# EAGLE design EEZ AUX PS r5B8 (EAGLE 6.1)
Assembly variants: Farnell, TME

## Sheet 1 of 2
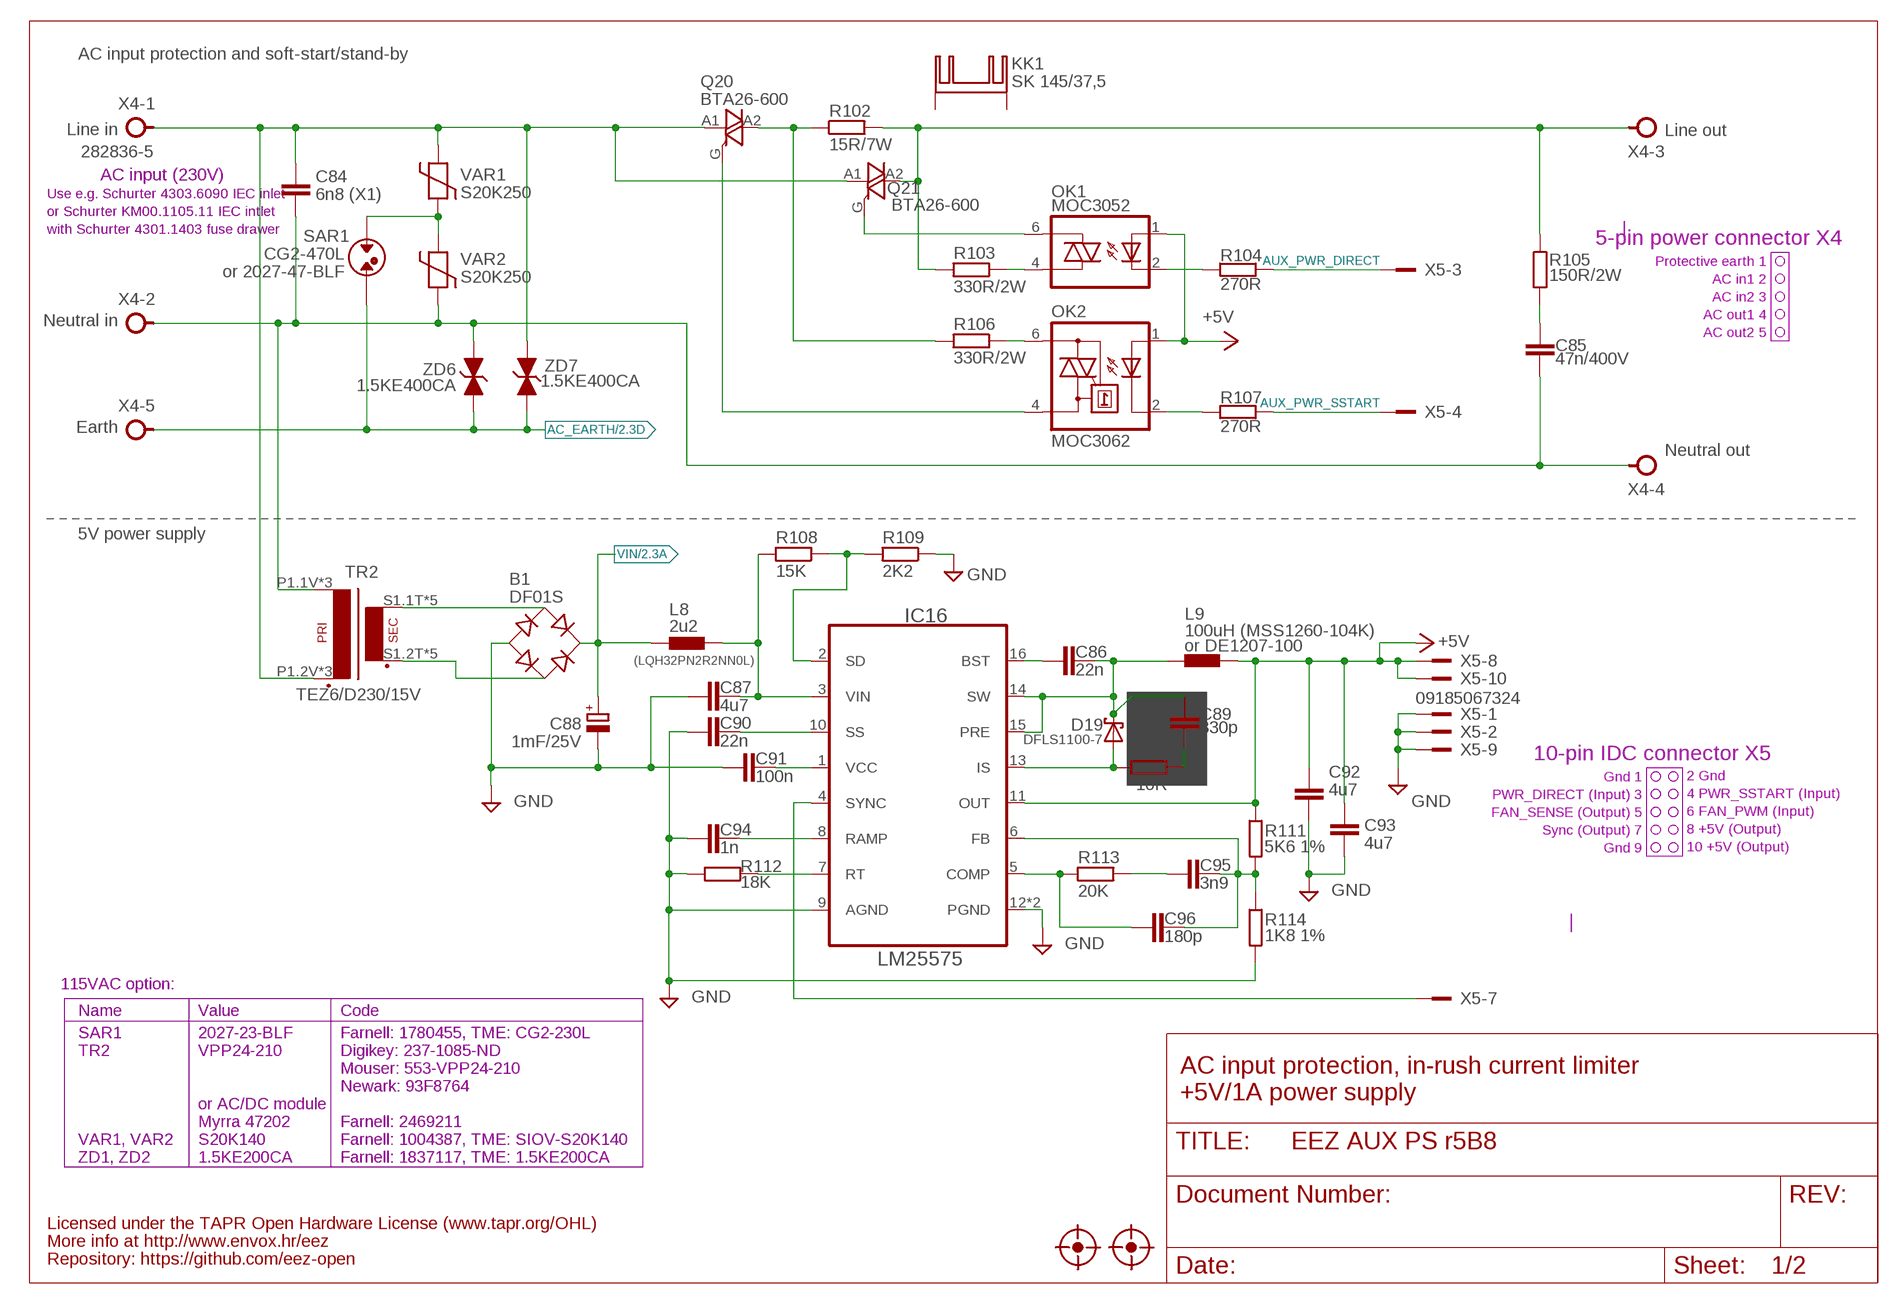
[diagram p0: schematic, sheet 1]

### Parts
B1  DF01S  [DFS]
C84  6n8 (X1)  C-EU102-064X133  [C102-064X133]
C85  47n/400V  C-EU075-052X106  [C075-052X106]
C86  22n  C-EUC0805  [C0805]
C87  4u7  C-EUC1210  [C1210]
C88  1mF/25V  ECAP5G_10.5MM  [ECAP5/10.5]
C89  330p  C-EUC0805  [C0805]
C90  22n  C-EUC0805  [C0805]
C91  100n  C-EUC0805  [C0805]
C92  4u7  C-EUC1210  [C1210]
C93  4u7  C-EUC1210  [C1210]
C94  1n  C-EUC0805  [C0805]
C95  3n9  C-EUC0805  [C0805]
C96  180p  C-EUC0805  [C0805]
D19  DFLS1100-7  SCHOTTKYSOD123  [SOD123]
IC16  LM25575  LM(2)5575  [SOP65P640X110-17N]
KK1  SK 145/37,5  SK145  [SK145]
L8  2u2  L1210  [L1210]
L9  100uH (MSS1260-104K)  COILCRAFT_MSS1278  [MSS1278]
OK1  MOC3052  MOC305X  [DIL6-SMD]
OK2  MOC3062  MOC3033S  [DIL6-SMD]
Q20  BTA26-600  BTA26-V  [TOP3S-1]
Q21  BTA26-600  BTA26-V  [TOP3S-1]
R102  15R/7W  R_EU7W  [R_0913]
R103  330R/2W  R-EU_R2512  [R2512]
R104  270R  R-EU_R0805  [R0805]
R105  150R/2W  R-EU_R2512  [R2512]
R106  330R/2W  R-EU_R2512  [R2512]
R107  270R  R-EU_R0805  [R0805]
R108  15K  R-EU_R0805  [R0805]
R109  2K2  R-EU_R0805  [R0805]
R110  10R  R-EU_R1206  [R1206]
R111  5K6 1%  R-EU_R0805  [R0805]
R112  18K  R-EU_R0805  [R0805]
R113  20K  R-EU_R0805  [R0805]
R114  1K8 1%  R-EU_R0805  [R0805]
SAR1  CG2-470L  SAR  [SAR]
TR2  TEZ6/D230/15V  PCB_TRAFO6VA_TEZ+VPP+MYRRA  [PCB_TRAFO6VA_7.5W]
U$13  FIDUCIAL_2  [FIDUCIAL_DUAL]
U$14  FIDUCIAL_2  [FIDUCIAL_DUAL]
VAR1  S20K250  VARISTOR  [VARISTOR]
VAR2  S20K250  VARISTOR  [VARISTOR]
X4  282836-5  TBLOCK5.0_5A  [TBLOCK5.0_5]
X5  09185067324  IDC-10PINBLACK  [IDC-10PIN]
ZD6  1.5KE400CA  1.5KE-BIDIR  [DO201-BIDIR]
ZD7  1.5KE400CA  1.5KE-BIDIR  [DO201-BIDIR]

### Nets
+5V: C92.1 C93.1 IC16.11(OUT) L9.2 OK1.1(A) OK2.1(A) R111.1 X5.8 X5.10 ; also sheet 2
AC_EARTH: SAR1.P$2 X4.5 ZD6.C ZD7.C ; also sheet 2
AC_IN1_MAIN: C84.1 Q20.A1 Q21.A1 TR2.P1.2V(P2) TR2.P2.2V(P2) TR2.P2_TEZ(P2) VAR1.P$2 X4.1 ZD7.A
AC_IN2_MAIN: C84.2 C85.1 TR2.P1.1V(P1) TR2.P1_TEZ(P1) TR2.P2.1V(P1) VAR2.P$1 X4.2 X4.4 ZD6.A
AUX_PWR_DIRECT: R104.2 X5.3
AUX_PWR_SSTART: R107.2 X5.4
DC_PREG2: C87.1 IC16.3(VIN) L8.2 R108.2
GND [gnd]: B1.- C87.2 C88.- C90.2 C91.1 C92.2 C93.2 C94.1 IC16.9(AGND) IC16.12(PGND) IC16.TP(PGND) R109.1 R112.2 R114.2 X5.1 X5.2 X5.9 ; also sheet 2
IS1: D19.A IC16.13(IS) R110.1
N$52: C95.2 R113.2
N$57: C95.1 C96.1 IC16.6(FB) R111.2 R114.1
N$58: C86.2 IC16.16(BST)
N$59: C96.2 IC16.5(COMP) R113.1
N$60: IC16.7(RT) R112.1
N$61: C91.2 IC16.1(VCC)
N$63: C94.2 IC16.8(RAMP)
N$66: C90.1 IC16.10(SS)
N$68: IC16.4(SYNC) X5.7
N$69: IC16.2(SD) R108.1 R109.2
N$70: C89.2 R110.2
N$71: OK1.6(A2) Q21.G
N$72: OK2.4(A1) Q20.G
N$73: OK2.6(A2) R106.1
N$74: OK1.2(C) R104.1
N$75: OK2.2(C) R107.1
N$76: OK1.4(A1) R103.1
N$78: B1.AC1 TR2.S1.1T(S1) TR2.S1.1V(S1) TR2.S2.1T(S1) TR2.S2.1V(S1) TR2.S2M(S1)
N$80: B1.AC2 TR2.S1.2T(S2) TR2.S1.2V(S2) TR2.S1M(S2) TR2.S2.2T(S2) TR2.S2.2V(S2)
N$81: Q20.A2 R102.1 R106.2
N$82: Q21.A2 R102.2 R103.2 R105.1 X4.3
N$83: C85.2 R105.2
N$114: SAR1.P$1 VAR1.P$1 VAR2.P$2
SW2: C86.1 C89.1 D19.C IC16.14(SW) IC16.15(PRE) L9.1
VIN: B1.+ C88.+ L8.1 ; also sheet 2
Unconnected: KK1.1(K) KK1.2(K)

### Notes on the sheet
- AC input protection and soft-start/stand-by
- Line in
- Line out
- AC input (230V)
- Use e.g. Schurter 4303.6090 IEC inlet
- or Schurter KM00.1105.11 IEC intlet
- 5-pin power connector X4
- with Schurter 4301.1403 fuse drawer
- Protective earth 1
- or 2027-47-BLF
- AC in1 2
- AC in2 3
- AC out1 4
- Neutral in
- AC out2 5
- Earth
- Neutral out
- 5V power supply
- or DE1207-100
- (LQH32PN2R2NN0L)
- 10-pin IDC connector X5
- Gnd 1
- 2 Gnd
- PWR_DIRECT (Input) 3
- 4 PWR_SSTART (Input)
- FAN_SENSE (Output) 5
- 6 FAN_PWM (Input)
- Sync (Output) 7
- 8 +5V (Output)
- Gnd 9
- 10 +5V (Output)
- 115VAC option:
- Name | Value | Code
- SAR1 | 2027-23-BLF | Farnell: 1780455, TME: CG2-230L
- TR2 | VPP24-210 | Digikey: 237-1085-ND
- Mouser: 553-VPP24-210 | AC input protection, in-rush current limiter
- Newark: 93F8764
- +5V/1A power supply
- or AC/DC module
- Myrra 47202 | Farnell: 2469211
- VAR1, VAR2 | S20K140 | Farnell: 1004387, TME: SIOV-S20K140
- ZD1, ZD2 | 1.5KE200CA | Farnell: 1837117, TME: 1.5KE200CA
- Licensed under the TAPR Open Hardware License (www.tapr.org/OHL)
- More info at http://www.envox.hr/eez
- Repository: https://github.com/eez-open

## Sheet 2 of 2
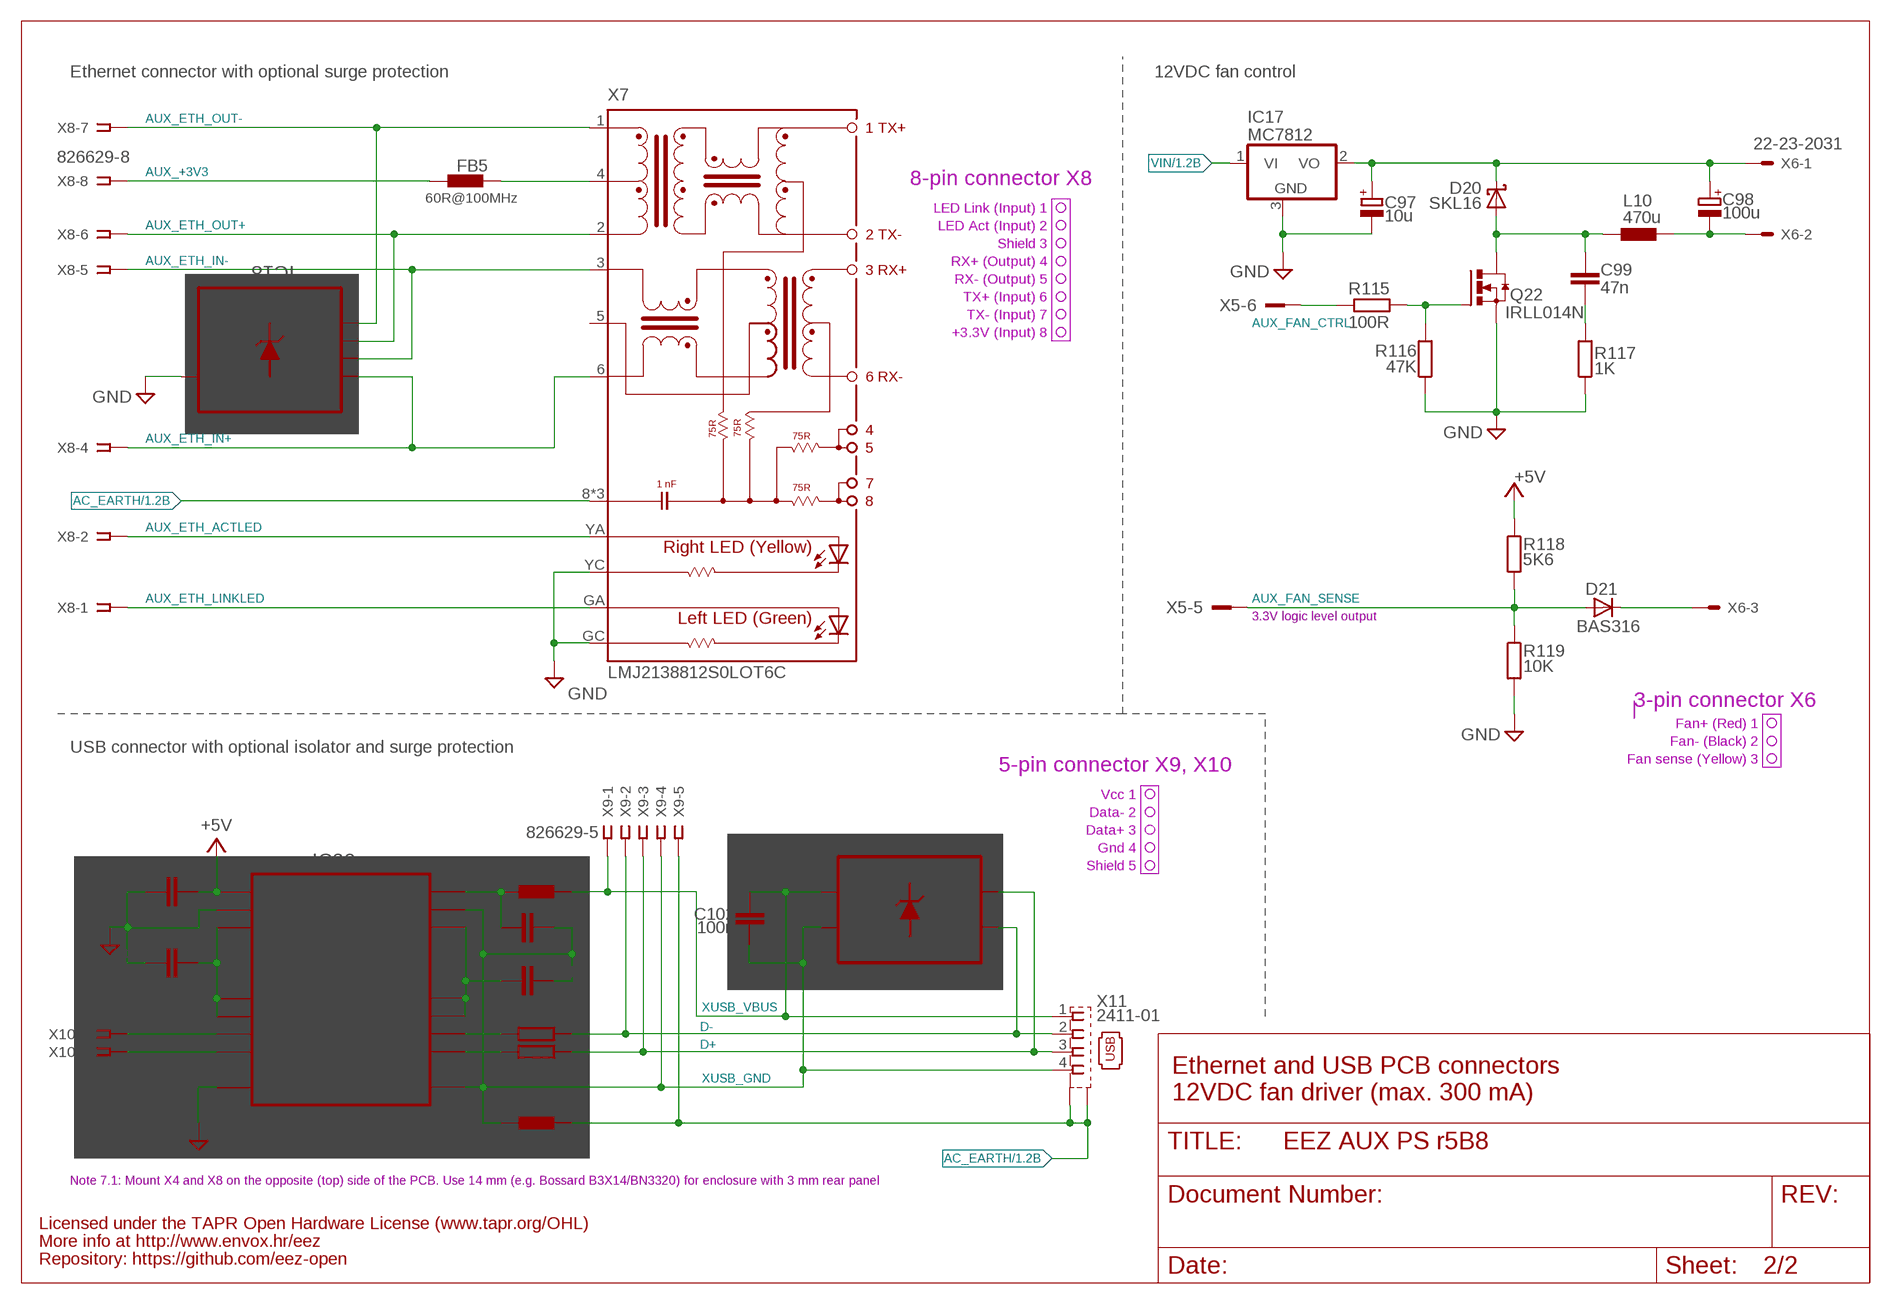
[diagram p1: schematic, sheet 2]

### Parts
C97  10u  ECAPPANASONIC_C  [PANASONIC_C]
C98  100u  ECAPPANASONIC_H  [CAPAE660X610N]
C99  47n  C-EUC0805  [C0805]
C100  100n  C-EUC0603  [C0603]
C101  100n  C-EUC0603  [C0603]
C102  100n  C-EUC0603  [C0603]
C103  100n  C-EUC0603  [C0603]
C104  100n  C-EUC0603  [C0603]
D20  SKL16  SCHOTTKYSOD123  [SOD123]
D21  BAS316  DIODE-SOD323-W  [SOD323-W]
FB5  60R@100MHz  FERRITE_BEAD0603  [BEAD0603]
FB6  60R@100MHz  FERRITE_BEAD0603  [BEAD0603]
FB7  60R@100MHz  FERRITE_BEAD0603  [BEAD0603]
IC17  MC7812  MC78XX  [TO252]
IC18  TPD4E002DRLR  [SOT50P280X60-5N]
IC19  TPD2E001DZDR  [SOP192P292X122-4N]
IC20  ADUM3160BRWZ  ADUM3160BRWZWIDE  [SOIC-16W]
L10  470u  DE0704  [DE0704]
Q22  IRLL014N  N-HEXFET-2D_SOT232-IRLL014N  [SOT223]
R115  100R  R-EU_R0805  [R0805]
R116  47K  R-EU_R0805  [R0805]
R117  1K  R-EU_R0805  [R0805]
R118  5K6  R-EU_R0805  [R0805]
R119  10K  R-EU_R0805  [R0805]
R120  22R  R-EU_R0805  [R0805]
R121  22R  R-EU_R0805  [R0805]
X6  22-23-2031  [22-23-2031]
X7  LMJ2138812S0LOT6C  RJ45-VERT  [RJ45-VERT]
X8  826629-8  SSW-108-02-S-S  [SSW-108-02-S-S]
X9  826629-5  SSW-105-02-S-S  [SSW-105-02-S-S]
X10  826629-5  SSW-105-02-S-S  [SSW-105-02-S-S]
X11  2411-01  KUSBVX-BS1N  [KUSBVX-BS1N]

### Nets
12VDC: C97.1(+) C98.1(+) D20.C IC17.2(VO) X6.1
+5V: C100.1 IC20.16(VBUS2) R118.1 ; also sheet 1
AC_EARTH: FB7.P$1 X7.8(SH) X7.SH1(SH) X7.SH2(SH) X9.5 X11.M1(S1) X11.M2(S2) ; also sheet 1
AUX_+3V3: FB5.P$2 X8.8
AUX_ETH_ACTLED: X7.YA(YELLOW_A) X8.2
AUX_ETH_IN+: IC18.5(IO4) X7.6(RD-) X8.4
AUX_ETH_IN-: IC18.4(IO3) X7.3(RD+) X8.5
AUX_ETH_LINKLED: X7.GA(GREEN-A) X8.1
AUX_ETH_OUT+: IC18.3(IO2) X7.2(TD-) X8.6
AUX_ETH_OUT-: IC18.1(IO1) X7.1(TD+) X8.7
AUX_FAN_CTRL: R115.2 X5.6
AUX_FAN_SENSE: D21.A R118.2 R119.1 X5.5
D+: IC19.2(IO1) R121.1 X9.3 X11.3
D-: IC19.3(IO2) R120.1 X9.2 X11.2
FAN_OUT: C99.2 D20.A L10.2 Q22.2(D) Q22.4(D)
GND [gnd]: C97.2(-) C100.2 C103.2 IC17.3(GND) IC18.2(GND) IC20.9(GND2) IC20.15(GND2_2) Q22.3(S) R116.1 R117.1 R119.2 X7.GC(GREEN-C) X7.YC(YELLOW-C) ; supply symbol labelled PGND ; also sheet 1
MCU_D+: IC20.10(DD+) X10.3
MCU_D-: IC20.11(DD-) X10.2
N$84: C99.1 R117.2
N$85: Q22.1(G) R115.1 R116.2
N$86: C98.2(-) L10.1 X6.2
N$87: C104.1 IC20.3(VDD1) IC20.4(PDEN) IC20.5(SPU)
N$88: IC20.6(UD-) R120.2
N$89: IC20.7(UD+) R121.2
N$90: C101.1 FB6.P$2 IC20.1(VBUS1)
N$91: C103.1 IC20.12(PIN) IC20.13(SPD) IC20.14(VDD2)
N$125: FB5.P$1 X7.4(CT)
N$163: D21.C X6.3
VIN: IC17.1(VI) ; also sheet 1
XUSB_GND: C101.2 C102.1 C104.2 FB7.P$2 IC19.1(GND) IC20.2(GND1_2) IC20.8(GND1) X9.4 X11.4
XUSB_VBUS: C102.2 FB6.P$1 IC19.4(VCC) X9.1 X11.1
Unconnected: X7.5(CR) X8.3 X10.1 X10.4 X10.5

### Notes on the sheet
- Ethernet connector with optional surge protection | 12VDC fan control
- 8-pin connector X8
- LED Link (Input) 1
- LED Act (Input) 2
- Shield 3
- RX+ (Output) 4
- RX- (Output) 5
- TX+ (Input) 6
- TX- (Input) 7
- +3.3V (Input) 8
- 3.3V logic level output
- 3-pin connector X6
- Fan+ (Red) 1
- Fan- (Black) 2
- USB connector with optional isolator and surge protection
- Fan sense (Yellow) 3
- 5-pin connector X9, X10
- Vcc 1
- Data- 2
- Data+ 3
- Gnd 4
- Shield 5
- Ethernet and USB PCB connectors
- 12VDC fan driver (max. 300 mA)
- Note 7.1: Mount X4 and X8 on the opposite (top) side of the PCB. Use 14 mm (e.g. Bossard B3X14/BN3320) for enclosure with 3 mm rear panel
- Licensed under the TAPR Open Hardware License (www.tapr.org/OHL)
- More info at http://www.envox.hr/eez
- Repository: https://github.com/eez-open

## Library data of the parts
B1 = rectifier:DF*S: Surface Mount Glass Passivated Bridge Rectifiers Source: Source: Comchip Bridge Rectifiers DF005S-G thru DF10S-G.pdf
C84-C87 C89-C96 C99-C104 = rcl:C-EU: CAPACITOR, European symbol
C88 C98 = EEZ_Lib1:ECAP
C97 = MyLib6:ECAP
D19 D20 = EEZ_Lib1:SCHOTTKY
D21 = diode:DIODE-: DIODE
FB5-FB7 = MyLib6:FERRITE_BEAD: FAIR-RITE - 2506033007Y3 - FERRITE BEAD, 0.04OHM, 3A, 0603 Farnell: 2112873
IC16 = EEZ_Lib1:LM(2)5575: Simple Switcher® 42V, 1.5A Step-Down Switching Regulator
IC17 = EEZ_Lib1:MC78XX: 1.0 A Positive Voltage Regulators
IC18 = EEZ_Lib1:TPD4E002: Low-Capacitance 4-Channel +/-15-kV ESD Protection Array for High-Speed Data Interfaces
IC19 = EEZ_Lib1:TPD2E001: Low-Capacitance 2-Channel +/-15 kV ESD-Protection Array for High-Speed Data Interfaces
IC20 = MyLib6:ADUM3160BRWZ: Full/Low Speed 2.5 kV USB Digital Isolator
KK1 = EEZ_Lib1:SK145: FISCHER ELEKTRONIK SK 145/37,5 STS-220 Heat Sink, TO-220, TO-218, TO-220, TO-247, TO-248, 12 °C/W, 29 mm, 12 mm
L8 = EEZ_Lib1:L1210
L9 = EEZ_Lib1:COILCRAFT_MSS1278: Coilcraft SMT Power Inductors – MSS1278
L10 = EEZ_Lib1:DE0704: Ferrocore SMD power coil 7.3 x 7.3 mm
OK1 = EEZ_Lib1:MOC305X: 6-pin DIP Random-phase Optoisolators Triac Drivers (600V Peak)
OK2 = optocoupler:MOC30*: 6-Pin DIP Zero-Cross Optoisolators Triac Driver Output (250/400 Volt Peak) Source: http://www.fairchildsemi.com/ds/MO/MOC3043-M.pdf; MF: FAIRCHILD SEMICONDUCTOR; MPN: MOC3033S-M; OC_FARNELL: unknown; OC_NEWARK: 05C2878
Q20 Q21 = triac:BTA26: 25A TRIAC Source: http://www.st.com/stonline/products/literature/ds/7470.pdf
Q22 = transistor-power:N-HEXFET-2D_?-*: HEXFET® Power MOSFET 2 Drain connects http://www.irf.com/product-info/datasheets/data/irll014n.pdf
R102 = EEZ_Lib1:R_EU: RESISTOR - European symbol
R103-R121 = rcl:R-EU_: RESISTOR, European symbol
SAR1 = EEZ_Lib1:SAR: EPCOS surge arrester EF470X Farnell: 1886596
TR2 = EEZ_Lib1:PCB_TRAFO6VA_TEZ+VPP: Breve Tufvassons TEZ 6/D or Triad Magnetics VPP
U$13 U$14 = EEZ_Lib1:FIDUCIAL: Fiducial mark for pick and place automation
VAR1 VAR2 = EEZ_Lib1:VARISTOR: EPCOS - B72220S0251K101 - VARISTOR, 140J, 250VAC Farnell: 1004357
X4 = EEZ_Lib1:TBLOCK5.0_5A
X5 = EEZ_Lib1:IDC-10PIN: 10-pin IDC socket male, straight; TME: T821-1-10-S1
X6 = con-molex:22-23-2031: .100" (2.54mm) Center Header - 3 Pin; MF: MOLEX; MPN: 22-23-2031; OC_FARNELL: 1462950; OC_NEWARK: 30C0862
X7 = EEZ_Lib1:RJ45-VERT: AMPHENOL LMJ2138812S0LOT6C Socket; RJ45; PIN:8; vertical, shielded, with LED and trafo; TME: LMJ2138812S0LOT6C
X8 = con-samtec:SSW-108-02-S-S: THROUGH-HOLE .025" SQ POST SOCKET Source: Samtec SSW.pdf; MPN: SSW-108-02-S-S; OC_FARNELL: unknown; OC_NEWARK: 11P9448
X9 X10 = con-samtec:SSW-105-02-S-S: THROUGH-HOLE .025" SQ POST SOCKET Source: Samtec SSW.pdf; MPN: SSW-105-02-S-S; OC_FARNELL: unknown; OC_NEWARK: 11P9399
X11 = con-kycon:KUSBVX-BS1N: USB B-type Receptacle Vertical, 4 Position, Through Hole Source: Sibalco Kycon KUSBVX-BS1N-xxx.pdf
ZD6 ZD7 = EEZ_Lib1:1.5KE-BIDIR

## Net classes
0 default: width 0.254 mm, drill 0.584 mm, clearance 0.254 mm
1 dgnd: width 0.254 mm, drill 0.584 mm, clearance 0.254 mm
2 gnd: width 0.254 mm, drill 0.584 mm, clearance 0.254 mm

## Board
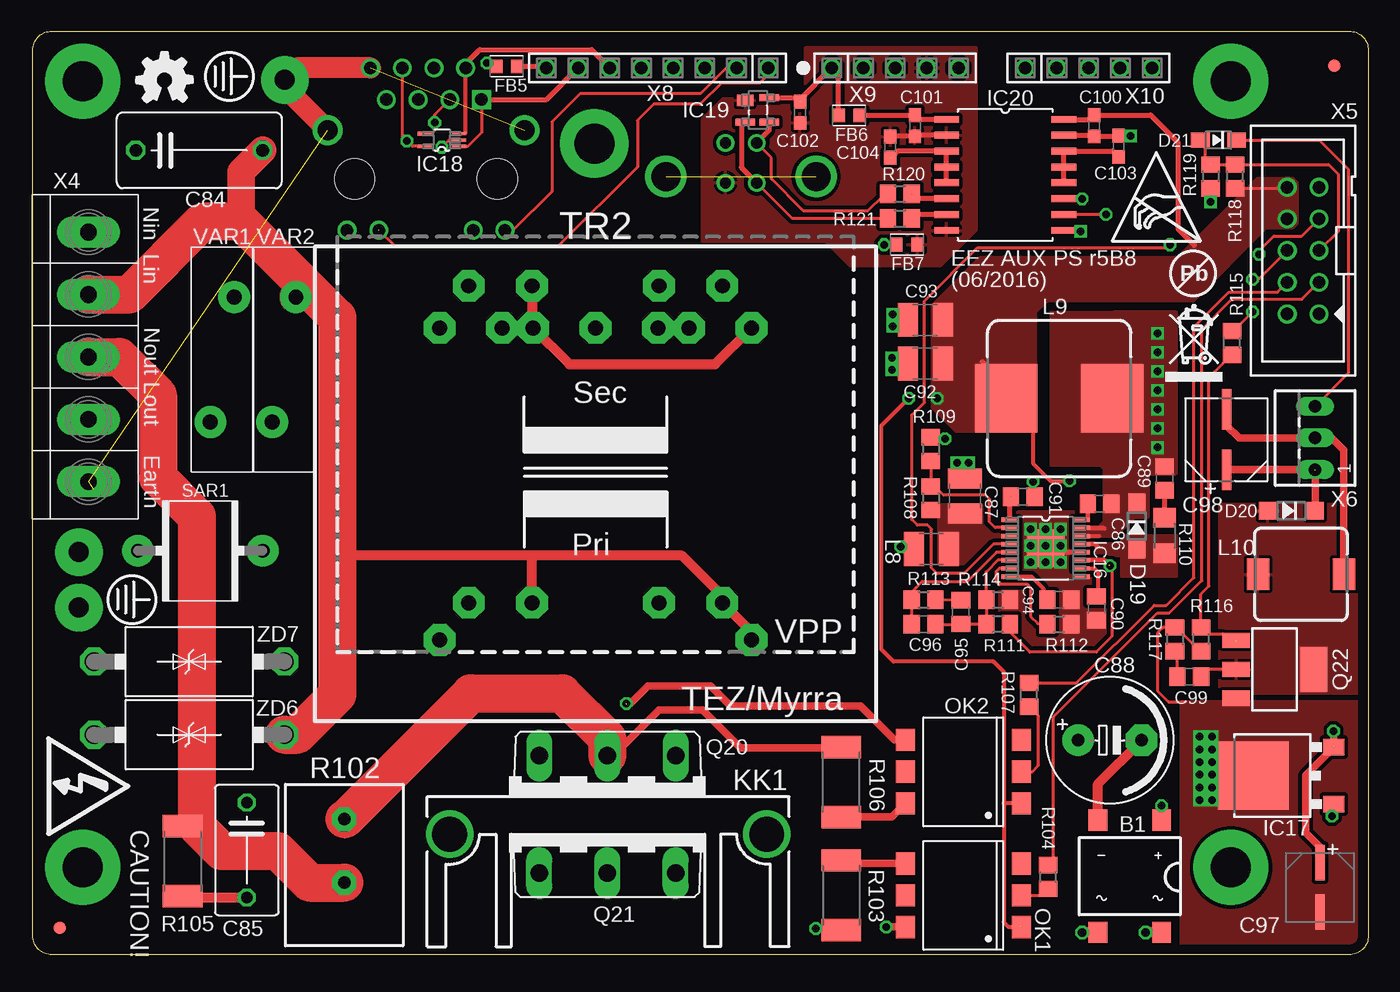
[diagram p2: board, top side]
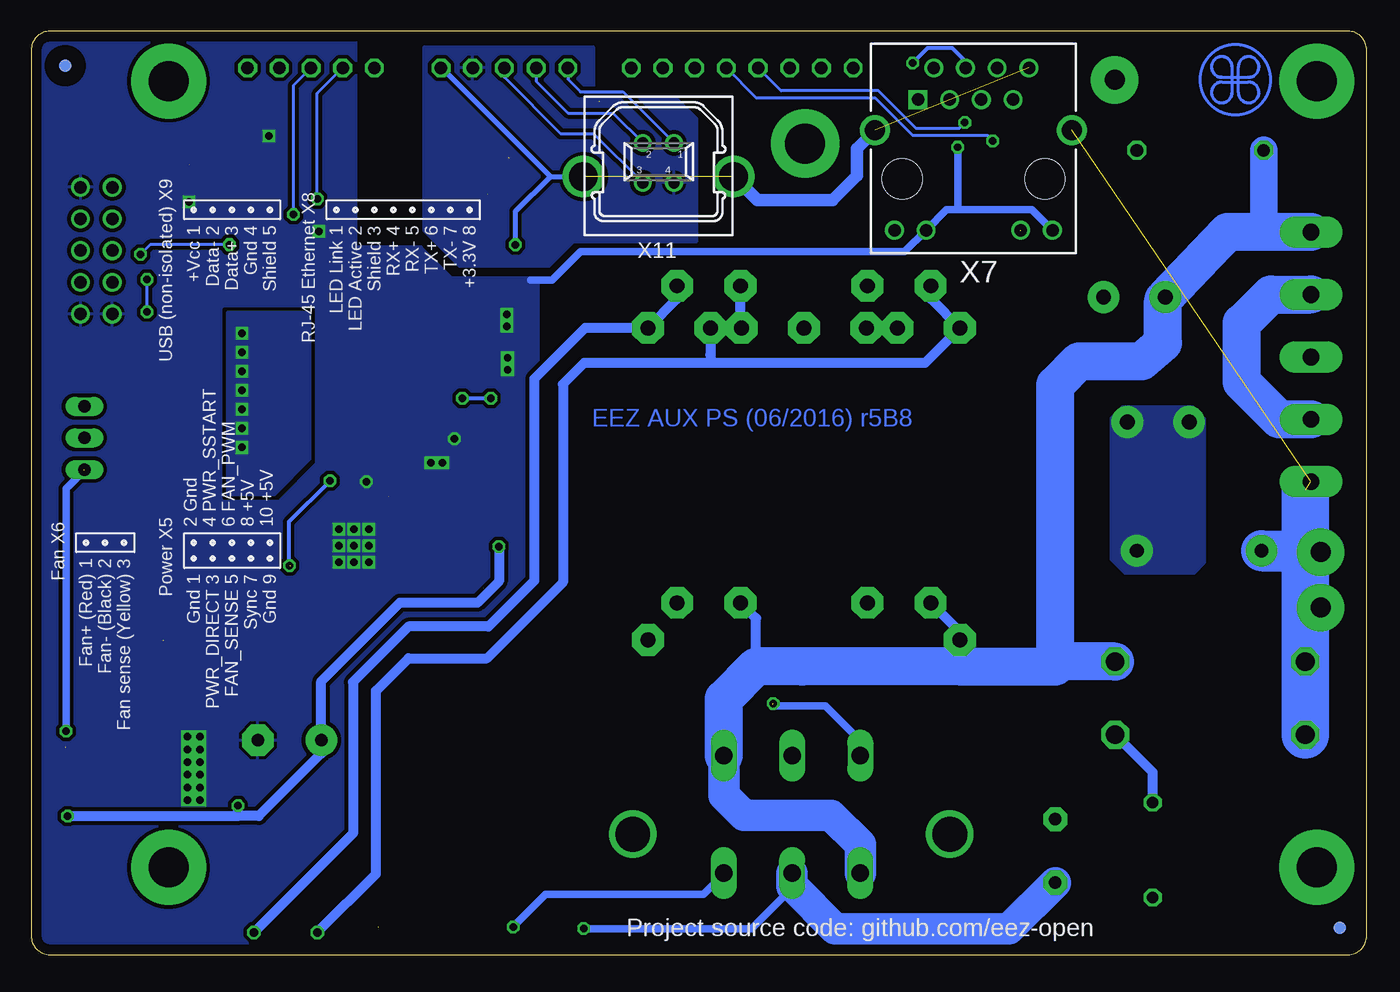
[diagram p3: board, bottom side, seen from below]

Size 107 x 74 mm. Coordinates in mm from the lower left corner, seen from the top.
Outline: 1.5,74 105.5,74 arc-90 107,72.5 107,1.5 arc-90 105.5,0 1.5,0 arc-90 0,1.5 0,72.5 arc-90 1.5,74
Copper layers (1+5*16): Top 0.035mm / dielectric 0.75mm / Route5 0.035mm / dielectric 0.75mm / Bottom 0.035mm
Design rules: minimum track width 10mil, minimum drill 0.5mm, track to track 8mil, track to pad 8mil, pad to pad 8mil, via to via 8mil, smd to smd 8mil, copper to edge 30mil, drill to drill 8mil, minimum pad ring 10mil, minimum via ring 8mil, stop-mask expansion 4mil, vias tented up to drill 25mil, thermal gap 10mil

### Footprints (pad centres in the part's own frame; a part is rotated, then mirrored left to right if it is on the bottom)
DFS = smd 1.5 x 1.7: + -2.55,-4.5; - 2.55,-4.5; AC1 -2.55,4.5; AC2 2.55,4.5
C102-064X133 = drill 1.016 octagon: 1 -5.08,0; 2 5.08,0
C075-052X106 = drill 0.914 octagon: 1 -3.81,0; 2 3.81,0
C0805 = smd 1.3 x 1.5: 1 -0.95,0; 2 0.95,0
C1210 = smd 1.6 x 2.7: 1 -1.4,0; 2 1.4,0
ECAP5/10.5 = drill 1.016 pad 2.54: + -2.54,0 | drill 1.016 pad 2.54 octagon: - 2.54,0
PANASONIC_C = smd 2.87 x 0.762: 1 -1.981,0; 2 1.981,0
CAPAE660X610N = smd 3.251 x 0.762: 1 -2.413,0; 2 2.413,0
C0603 = smd 1.1 x 1: 1 -0.85,0; 2 0.85,0
SOD123 = smd 1.4 x 1.4: A 1.9,0; C -1.9,0
SOD323-W = smd 1.5 x 1.2: A 1.45,0; C -1.45,0
BEAD0603 = smd 1 x 1.1: P$1 -0.85,0; P$2 0.85,0
SOP65P640X110-17N = smd 1.422 x 0.356: 1 -2.845,2.286; 2 -2.845,1.626; 3 -2.845,0.965; 4 -2.845,0.33; 5 -2.845,-0.33; 6 -2.845,-0.965; 7 -2.845,-1.626; 8 -2.845,-2.286; 9 2.845,-2.286; 10 2.845,-1.626; 11 2.845,-0.965; 12 2.845,-0.33; 13 2.845,0.33; 14 2.845,0.965; 15 2.845,1.626; 16 2.845,2.286 | smd 2.997 x 2.997: TP 0,0
TO252 = smd 1.3 x 1.7: 1 -2.285,-5.49; 2 2.285,-5.49 | smd 5.5 x 5.7: 3 0,0.95
SOT50P280X60-5N = smd 1.118 x 0.254: 1 -1.372,0.508; 2 -1.372,0; 3 -1.372,-0.508 | smd 1.118 x 0.305: 4 1.372,-0.508; 5 1.372,0.508
SOP192P292X122-4N = smd 0.94 x 1.321: 1 -0.762,-1.016 | smd 0.559 x 1.575: 2 0.965,-1.016; 3 0.965,0.889; 4 -0.965,0.889
SOIC-16W = smd 1.981 x 0.559: 1 -4.699,4.445; 2 -4.699,3.175; 3 -4.699,1.905; 4 -4.699,0.635; 5 -4.699,-0.635; 6 -4.699,-1.905; 7 -4.699,-3.175; 8 -4.699,-4.445; 9 4.699,-4.445; 10 4.699,-3.175; 11 4.699,-1.905; 12 4.699,-0.635; 13 4.699,0.635; 14 4.699,1.905; 15 4.699,3.175; 16 4.699,4.445
SK145 = drill 2.8: 1 -12.7,0; 2 12.7,0
L1210 = smd 1.6 x 2.7: 1 -1.4,0; 2 1.4,0
MSS1278 = smd 5.5 x 5: 1 0,4.25; 2 0,-4.25
DE0704 = smd 2.5 x 1.8: 1 0,3.45; 2 0,-3.45
DIL6-SMD = smd 1.78 x 1.52: 1 -2.54,-4.645; 2 0,-4.645; 3 2.54,-4.645; 4 2.54,4.645; 5 0,4.645; 6 -2.54,4.645
TOP3S-1 = drill 1.397 long: A1 -5.461,-3.175; A2 0,-3.175; G 5.461,-3.175
SOT223 = smd 1.219 x 2.235: 1 -2.311,-3.099; 2 0,-3.099; 3 2.311,-3.099 | smd 3.6 x 2.2: 4 0,3.099
R_0913 = drill 1.016 pad 1.93 octagon: 1 -3.556,0; 2 1.524,0
R2512 = smd 1.8 x 3.2: 1 -2.8,0; 2 2.8,0
R0805 = smd 1.3 x 1.5: 1 -0.95,0; 2 0.95,0
R1206 = smd 1.6 x 1.803: 1 -1.422,0; 2 1.422,0
SAR = drill 1.1 pad 2.54: P$1 0,0; P$2 10,0
PCB_TRAFO6VA_7.5W = drill 1.2 pad 2.54 octagon: NC -12.5,0; P1.1V 9.525,10.16; P1.2V 9.525,5.08; P1_TEZ 12.5,12.5; P2.1V 9.525,-5.08; P2.2V 9.525,-10.16; P2_TEZ 12.5,-12.5; S1.1T -12.5,12.5; S1.1V -15.875,10.16; S1.2T -12.5,7.5; S1.2V -15.875,5.08; S1M -12.5,5; S2.1T -12.5,-7.5; S2.1V -15.875,-5.08; S2.2T -12.5,-12.5; S2.2V -15.875,-10.16; S2M -12.5,-5
FIDUCIAL_DUAL = smd 1.016 x 1.016 bottom: B 0,0 | smd 1.016 x 1.016: T 0,0
VARISTOR = drill 1.2 pad 2.54: P$1 -5,0.95; P$2 5,-0.95
TBLOCK5.0_5 = drill 1.35 pad 2.54 long: 1 0,0; 2 0,-5; 3 0,-10; 4 0,-15; 5 0,-20
IDC-10PIN = drill 1 pad 1.422: 1 -5.08,-1.27; 2 -5.08,1.27; 3 -2.54,-1.27; 4 -2.54,1.27; 5 0,-1.27; 6 0,1.27; 7 2.54,-1.27; 8 2.54,1.27; 9 5.08,-1.27; 10 5.08,1.27
22-23-2031 = drill 1 long: 1 -2.54,0; 2 0,0; 3 2.54,0
RJ45-VERT = drill 1 square: 1 4.445,-5.08 | drill 1: 2 3.175,-7.62; 3 1.905,-5.08; 4 0.635,-7.62; 5 -0.635,-5.08; 6 -1.905,-7.62; 7 -3.175,-5.08; 8 -4.445,-7.62; GA -3.785,5.38; GC -6.325,5.38; YA 6.325,5.38; YC 3.785,5.38 | drill 1.6: SH1 7.875,-2.62; SH2 -7.875,-2.62 | hole 3.2: -5.715,1.27; 5.715,1.27
SSW-108-02-S-S = drill 1 pad 1.5 octagon: 1 -8.89,0; 2 -6.35,0; 3 -3.81,0; 4 -1.27,0; 5 1.27,0; 6 3.81,0; 7 6.35,0; 8 8.89,0
SSW-105-02-S-S = drill 1 pad 1.5 octagon: 1 -5.08,0; 2 -2.54,0; 3 0,0; 4 2.54,0; 5 5.08,0
KUSBVX-BS1N = drill 0.9 pad 1.422: 1 1.25,2.7; 2 -1.25,2.7; 3 -1.25,-0.5; 4 1.25,-0.5 | drill 2.3 pad 2.7: M1 -6.02,0; M2 6.02,0
DO201-BIDIR = drill 1.499 octagon: A 7.62,0; C -7.62,0

### Placement (x,y rotation side)
B1  87.88,6.29 180 top
C84  13.34,64.45 0 top
C85  17.14,8.38 270 top
C86  85.47,36.13 180 top
C87  74.68,36.77 90 top
C88  86.3,17.18 0 top
C89  90.68,38.16 270 top
C90  85.22,27.75 270 top
C91  79.31,36.7 180 top
C92  71.5,47.37 180 top
C93  71.5,50.86 180 top
C94  82.23,28.45 180 top
C95  74.36,27.46 90 top
C96  71.37,26.48 180 top
C97  103.12,5.4 270 top
C98  95.63,41.27 90 top
C99  92.65,22.29 0 top
C100  85.03,66.42 270 top
C101  70.68,66.42 270 top
C102  61.47,67.5 90 top
C103  87,64.77 90 top
C104  68.71,64.71 90 top
D19  88.46,34.35 270 top
D20  100.84,35.56 180 top
D21  95,65.28 180 top
EEZ_SIGNATURE1  SIGNATURESMALL  [SIGNATURE_5MM]  10.54,70.11 180 top
FB5  37.97,71.18 0 top
FB6  65.41,67.25 0 top
FB7  70.04,56.9 0 top
IC16  81.15,32.58 0 top
IC17  98.74,14.35 90 top
IC18  32.77,65.28 180 top
IC19  58.1,67.69 270 top
IC20  77.91,62.48 0 top
KK1  46.1,9.65 180 top
L8  72.01,32.51 0 top
L9  82.23,44.58 270 top
L10  101.6,30.48 270 top
OK1  74.55,4.76 90 top
OK2  74.55,14.67 90 top
Q20  46.04,12.76 180 top
Q21  46.04,9.72 0 top
Q22  99.5,22.86 270 top
R102  24.96,7.3 270 top
R103  64.77,4.76 270 top
R104  81.34,6.22 90 top
R105  12,7.49 270 top
R106  64.77,13.84 90 top
R107  79.82,20.83 90 top
R108  71.95,36.58 270 top
R109  71.95,40.51 270 top
R110  90.68,33.59 90 top
R111  77.34,26.48 180 top
R112  82.23,26.48 0 top
R113  71.37,28.45 0 top
R114  77.34,28.45 0 top
R115  96.08,49.02 90 top
R116  93.6,25.27 90 top
R117  91.5,25.27 270 top
R118  96.33,62.36 90 top
R119  94.36,62.36 270 top
R120  69.47,60.96 0 top
R121  69.47,58.99 0 top
SAR1  18.41,32.36 180 top
TR2  45.09,37.72 270 top
U$1  [RECYCLE_BIN1/8]  90.75,45.91 0 top
U$5  [PB_SMALL]  92.97,54.61 0 top
U$6  [ESD_SYMBOL]  86.46,57.19 0 top
U$13  2.16,2.16 0 top
U$14  104.27,71.25 0 top
VAR1  15.18,47.69 90 top
VAR2  20.13,47.69 270 top
X4  4.46,57.9 0 top
X5  101.78,56.42 90 top
X6  102.74,41.4 90 top
X7  31.51,63.43 180 bottom
X8  50.04,71.06 180 top
X9  69.09,71.06 0 top
X10  84.58,71.06 0 top
X11  56.75,62.35 0 bottom
ZD6  12.54,17.63 0 top
ZD7  12.54,23.48 0 top

### Tracks (layer width: path | path; a pad name or v marks a point on that pad's centre or on a via)
12VDC  (via drill 0.6)  (2 unrouted)
  Top 0.61: C98.1 X6.1 D20.C | IC17.2 104.23,17.91 v104.2,17.91 | C97.1 103.12,8.64 101.98,9.78 101.98,14.35 104.27,16.64
  Bottom 0.61: v104.2,17.91 104.2,37.34 102.74,38.8
+5V  (via drill 0.6)  (2 unrouted)
  Top 0.254: 86.23,31.18 86.49,30.92 86.49,25.53 85.22,24.26 79.88,24.26 78.3,25.84 78.3,26.35 78.23,26.42 78.29,26.42 R111.1 | R118.1 100.41,61.41 X5.10
  Top 0.305: 76.45,46.99 76.52,47.05 76.52,46.55 77.92,45.15 | 77.92,45.15 77.98,45.09 | L9.2 77.98,45.21 77.92,45.15 | 77.98,45.02 80.14,42.86 80.14,39.37 81.53,37.97 v83.06,37.97 | 77.79,12.13 77.79,22.67 76.96,23.5 68.96,23.5 68.01,24.45 68.01,42.42 v70.17,44.58 | 77.79,12.13 77.79,2.6 78.17,2.22 OK1.1 | OK2.1 77.79,12.13 | v72.45,44.58 72.26,44.58
  Top 0.356: IC16.11 85.86,31.61 v86.3,31.18
  Top 0.406: 76.07,47.5 76.52,47.05 | IC20.16 84.56,66.93 C100.1 89.57,67.27 91.76,65.09 91.76,58.17 93.09,56.83
  Bottom 0.305: v86.3,31.18 86.36,31.24 86.36,34.67 v83.06,37.97 | v70.17,44.58 v72.45,44.58
  pour Top (isolate 0.305, no thermals): 80.33,41.91 73.98,41.91 72.07,43.81 72.07,52.07 75.88,55.88 91.76,55.88 98.11,62.23 100.97,62.23 101.28,61.91 101.28,58.55 100.97,58.23 98.81,58.23 92.96,52.39 81.28,52.39 80.33,51.44
AC_EARTH  (via drill 0.6, 1.6 pad 3.81)  (4 unrouted)
  Top 0.406: FB7.P$1 v68.2,56.9
  Top 1.676: X7.SH2 20.19,69.49 v20.19,70.1 21.14,71.05 X7.8
  Bottom 0.254: v3.68,27.81 4.92,27.81 4.92,28
  Bottom 0.406: X9.5 74.11,71.06 65.41,62.36 | 65.41,62.36 X11.M1 | v68.2,56.9 68.2,59.56 65.41,62.36
  Bottom 1.016: X7.SH1 39.38,66.03 40.83,64.58 40.83,62.42 42.8,60.45 48.83,60.45 X11.M2
  Bottom 3.302: SAR1.P$2 5.11,32.36
  Bottom 3.81: ZD6.C ZD7.C 4.92,28 4.92,32.04 | 4.89,37.27 4.92,37.27 4.92,32.26 4.7,32.26 | v3.68,32.26 4.7,32.26 | 4.92,32.04 4.7,32.26 | 5.11,32.36 4.92,32.04
AC_IN1_MAIN
  Bottom 0.813: 45.34,23.22 45.21,23.09 | 32.51,23.09 32.59,23.16 TR2.P2_TEZ 32.59,25.85 TR2.P2.2V | 48.92,23.09 48.92,26.95 TR2.P1.2V | 23.37,22.84 24.96,23.09
  Bottom 2.184: C84.1 8.26,57.97 8.32,57.9
  Bottom 2.54: Q20.A1 51.5,12.76 49.91,11.18 42.93,11.18 40.58,8.83 Q21.A1
  Bottom 3.048: Q20.A1 51.5,20.51 48.92,23.09 45.21,23.09 32.51,23.09 25.34,23.09 | 25.34,23.09 24.96,23.09 24.96,45.66 | X4.1 8.32,57.9 11.17,57.9 VAR1.P$2 16.32,52.43 16.32,49.02 18.03,47.56 23.05,47.56 24.96,45.66 | ZD7.A 24.94,23.48 25.34,23.09 | 24.96,45.66 24.89,45.66
AC_IN2_MAIN
  Top 0.813: TR2.P1_TEZ 57.59,25.85 TR2.P1.1V 55.24,28.74 52.01,31.98 39.81,31.98 | 39.81,31.98 24.47,31.98 24.38,32.07 | TR2.P2.1V 40.01,31.79 39.81,31.98
  Top 2.184: 16.7,58.74 16.7,62.74 C84.2
  Top 2.54: VAR2.P$1 21.02,52.7 21.88,53.56
  Top 3.048: ZD6.A 21.18,17.63 24.38,20.83 24.38,32.07 24.38,51.05 21.88,53.56 16.7,58.74 13.59,58.74 7.75,52.9 X4.2
  Bottom 0.813: C85.1 17.14,14.62 ZD6.A
  Bottom 3.048: X4.4 7.02,42.9 10.04,45.92 10.04,50.62 9.97,50.62 7.68,52.9 X4.2
AUX_+3V3
  Top 0.406: FB5.P$2 41.02,71.18 X8.8
AUX_ETH_ACTLED
  Top 0.254: X7.YA 38.5,58.05 41.59,61.15 41.59,66.74 43.88,69.03 53.53,69.03 55.56,71.06 X8.2
AUX_ETH_IN+  (via drill 0.6)
  Top 0.254: X7.6 29.6,65.58 v29.97,65.22 30.42,64.77 IC18.5
  Bottom 0.254: v29.97,65.22 30.35,65.66 36.39,65.66 39.37,68.64 48.9,68.64 X8.4
AUX_ETH_IN-  (via drill 0.6)
  Top 0.254: IC18.4 31.94,65.79 32.19,66.04 v32.19,66.67 32.19,67.3 X7.3
  Bottom 0.254: v32.19,66.67 32.64,66.23 36.13,66.23 39.12,69.22 46.93,69.22 X8.5
AUX_ETH_LINKLED  (1 unrouted)
  Top 0.254: 27.75,58.04 29.02,56.77 42.1,56.77 48.45,63.12 48.45,66.86 49.72,68.14 53.47,68.14 55.18,69.85 58.23,69.85 58.93,70.55 X8.1
AUX_ETH_OUT+
  Top 0.254: IC18.3 34.61,65.79 34.67,65.85
  Top 0.305: 34.67,65.85 X7.2
  Top 0.406: X7.2 34.68,71.39 35.81,72.52 44.77,72.52 X8.6
AUX_ETH_OUT-
  Top 0.254: X7.1 35.95,65.86 34.86,64.77 IC18.1
  Top 0.406: X7.1 41.15,68.51 X8.7
AUX_FAN_CTRL  (via drill 0.6)
  Top 0.254: R115.2 96.2,49.97 v97.73,51.5 | v97.73,54.1 98.19,54.1 X5.6
  Bottom 0.254: v97.73,51.5 v97.73,54.1
AUX_FAN_SENSE  (1 unrouted)
  Top 0.254: D21.A 93.79,65.28 93.92,65.15 93.92,63.75 R119.1 | R119.1 R118.2 103.83,63.31 104.58,62.55 104.58,57.96 X5.5
AUX_PWR_DIRECT
  Top 0.254: R104.2 81.79,7.62 81.79,19.05 90.11,27.37 91.06,27.37 93.66,29.97 93.66,50.1 96.08,52.51 101.68,52.51 X5.3
AUX_PWR_SSTART
  Top 0.254: R107.2 83.63,21.78 89.85,28 90.81,28 93.03,30.23 93.03,50.29 95.82,53.09 99.71,53.09 X5.4 | X5.4 100.49,53.88 | 100.47,53.85 X5.4
D+
  Top 0.254: R121.1 60.86,58.99 X11.3
  Top 0.406: IC19.2 57.01,66.73 56.77,66.74 56.77,63.08 X11.3
  Bottom 0.254: X9.3 69.09,70.29 64.58,65.79 61.93,65.79 X11.3
D-
  Top 0.254: R120.1 68.14,60.96 68.14,60.83 66.93,59.63 61.72,59.63 59.18,62.17 59.18,63.87 X11.2
  Top 0.406: IC19.3 58.99,66.05 X11.2
  Bottom 0.254: X9.2 66.55,69.98 64.01,67.44 60.38,67.44 X11.2
DC_PREG2
  pour Top (isolate 0.305, rank 2, no thermals): 78.3,34.35 78.3,33.02 77.15,33.02 75.44,31.31 72.58,31.31 72.58,36.07 76.01,36.07 76.01,34.35
FAN_OUT
  Top 0.254: Q22.2 94.17,22.86 C99.2
  pour Top: 106.49,36.13 106.49,20.95 95.12,20.95 95.12,36.13
  pour Top (no thermals): 103.82,25.15 103.89,20.95 100.58,20.95 100.52,25.15
GND  (via drill 0.6)
  Top 0.254: v74.99,39.43 74.99,38.48 C87.2 | IC18.2 33.34,65.28 v32.77,64.71 | IC20.9 83.57,58.04 v83.95,57.98 | v94.36,60.33 R119.2 | v73.09,41.34 72.14,41.34 R109.1 | R116.1 93.47,24.32 93.47,24.39 91.63,26.22 R117.1 90.55,26.22 90.11,25.78 90.11,21.14 91,20.26 92.39,20.26
  Top 0.305: v68.9,50.35 69.59,50.35 C93.2 | C91.1 v80.14,37.91 | v68.83,46.86 69.66,46.86 C92.2
  Top 0.406: IC20.15 84.99,65.66 C100.2 86.98,65.57 C103.2 87.91,65.62 v87.95,65.6 | IC16.12 82.44,32.24 82.42,32.26
  Top 0.813: B1.- 85.33,13.68 C88.-
  Bottom 0.61: 32.77,59.69 26.82,59.69 X7.GC | 32.77,59.69 33.66,59.69 X7.YC 37.02,56.33 62.99,56.33 65.28,54.04 66.99,54.04 | v32.77,64.71 32.77,59.69
  other vias: 68.9,51.31 68.83,47.82 82.35,34.1 81.15,34.1 79.96,34.1 74.04,39.43 81.14,31.43 79.95,31.43 94.49,14.41 93.47,17.46 94.49,17.46 94.49,16.45 94.49,13.4 94.49,12.38 93.47,12.38 94.49,15.43 93.47,16.45 93.47,15.43 93.47,14.41 93.47,13.4 82.35,31.43 82.35,32.77 81.14,32.77 79.93,32.77
  pour Top (isolate 0.305, no thermals): 83.38,35.5 83.38,30.16 86.36,30.16 86.36,25.78 85.28,24.7 77.47,24.7 77.47,29.27 78.93,29.27 78.93,35.5
  pour Bottom (isolate 0.305, rank 2): 107.31,73.66 107.31,-0.32 78.11,-0.32 78.11,23.37 66.36,23.37 66.36,54.23 73.28,54.23 75.76,56.71 80.96,56.71 80.96,73.66
  pour Top (isolate 0.305, no thermals): 106.43,20.26 106.43,0.19 92.08,0.19 92.08,20.26
IS1
  Top 0.356: IC16.13 85.08,32.91 85.28,32.7
  pour Top (isolate 0.305, no thermals): 84.26,32.96 87,32.96 87.63,33.59 91.63,33.59 91.63,30.29 87.25,30.29 87.25,31.94 85.22,31.94 85.22,32.7 85.09,32.83 84.26,32.83
MCU_D+  (via drill 0.6)
  Top 0.254: v85.98,59.31 IC20.10
  Bottom 0.254: v85.98,59.31 85.98,69.66 X10.3
MCU_D-  (via drill 0.6)
  Top 0.254: IC20.11 v84.07,60.58
  Bottom 0.254: v84.07,60.58 84.07,69.03 X10.2
N$52
  Top 0.254: C95.2 72.52,28.38 R113.2
N$57
  Top 0.254: IC16.6 77.33,31.61 76.39,30.67 R114.1 R111.2 74.55,26.48 C95.1 74.42,26.48 C96.1
N$58
  Top 0.356: C86.2 84.52,34.93 84.45,34.86 IC16.16
N$59  (1 unrouted)
  Top 0.254: IC16.5 77.2,32.24 74.87,29.91 71.25,29.91 70.74,29.4 | C96.2 R113.1 70.42,29.09 70.74,29.4
N$60
  Top 0.254: IC16.7 77.43,30.95 77.22,30.73 77.22,29.91 77.47,29.65 79.69,29.65 79.95,29.4 79.95,27.11 80.52,26.54 R112.1
N$61  (1 unrouted)
  Top 0.356: IC16.1 78.31,35.04 78.3,35.05
  Top 0.406: 78.3,35.05 78.3,36.64 C91.2
N$63
  Top 0.254: 81.03,28.45 C94.2
  Top 0.305: IC16.8 80.01,30.29 80.96,29.34 80.96,28.51 81.03,28.45
N$66
  Top 0.305: IC16.10 85.06,30.95 85.34,30.67 85.34,28.83 C90.1
N$68  (via drill 0.6)
  Top 0.254: 78.31,32.89 IC16.4 76.97,32.91 74.61,30.54 72.45,30.54 72.01,30.99 72.01,34.1 71.69,34.42 70.87,34.42 70.42,34.86 70.42,43.24 71.44,44.26 71.44,52.39 75.69,56.64 90.87,56.64 v91.12,56.9 | v98.23,56.13 98.23,56.39 99.44,57.59 101.68,57.59 X5.7
  Bottom 0.254: v91.12,56.9 97.47,56.9 v98.23,56.13
N$69
  Top 0.254: IC16.2 78.31,34.23 | 78.31,34.23 78.36,34.23 | 78.31,34.23 77.09,34.23 76.64,34.67 76.64,36.51 76.33,36.83 72.96,36.83 72.27,37.53 R108.1 R109.2
N$70
  Top 0.406: C89.2 R110.2
N$71  (via drill 0.6)
  Top 0.61: OK1.6 v68.39,2.22
  Bottom 0.61: Q21.G 51.5,6.48 53.15,4.83 65.79,4.83 v68.39,2.22
N$72  (via drill 0.6)  (1 unrouted)
  Top 0.61: OK2.4 69.03,17.21 66.29,19.94 55.88,19.94 54.29,21.53 49.28,21.53 47.88,20.13 v47.56,20.13
  Bottom 0.61: Q20.G 40.58,17.14 43.37,19.94 47.43,19.94 47.56,20.07
N$73
  Top 0.61: R106.1 68.82,11.04 OK2.6
N$74
  Top 0.254: OK1.2 80.83,4.76 R104.1
N$75
  Top 0.254: OK2.2 80.07,14.67 80.58,15.18 80.58,19.12 R107.1
N$76
  Top 0.61: OK1.4 64.77,7.3 R103.1
N$78  (via drill 0.7)
  Top 0.813: TR2.S1.1T 54.67,47.31 43,47.31 TR2.S2M | B1.AC1 89.78,1.79 v89.15,1.78 | TR2.S2.1V 40.01,50.3 TR2.S2M | TR2.S2.1T TR2.S2M
  Bottom 0.813: TR2.S1.1V 55.24,52.56 TR2.S1.1T 62.62,50.22 66.67,46.16 66.67,29.97 70.36,26.29 76.77,26.29 81.22,21.84 81.22,9.72 v89.15,1.78
N$80  (via drill 0.7)
  Top 0.813: B1.AC2 84.51,1.79 v84.07,1.78
  Bottom 0.813: 52.58,47.43 62.67,47.43 64.39,45.72 64.39,29.84 70.48,23.75 76.77,23.75 79.38,21.14 79.38,6.48 v84.07,1.78 | TR2.S2.2V 34.92,52.56 TR2.S2.2T 35.37,47.43 52.58,47.43 | 52.58,47.43 52.59,48.08 TR2.S1.2T TR2.S1M 50.16,50.22 TR2.S1.2V
N$81
  Top 0.61: Q20.A2 46.48,15.94 50.16,19.62 53.66,19.62 56.71,16.57 64.7,16.57 R106.2
  Top 3.048: Q20.A2 46.04,17.34 42.42,20.95 35.12,20.95 25.02,10.86 R102.1
N$82  (via drill 0.6)
  Top 0.61: v62.74,2.1 64.38,2.1 R103.2
  Top 0.813: 13.14,10.29 R105.1
  Top 3.048: X4.3 6.96,47.9 10.03,44.83 10.03,38.23 13.14,35.12 13.14,10.29 15.11,8.32 19.62,8.32 22.16,5.78 R102.2
  Bottom 0.61: 46.04,5.46 46.04,5.33 49.28,2.1 v62.74,2.1
  Bottom 2.54: Q21.A2 46.04,5.46 45.99,5.46 42.61,2.08 28.65,2.08 R102.2
N$83
  Top 0.813: C85.2 12.12,4.57 R105.2
N$84
  Top 0.254: C99.1 91.7,24.13 R117.2
N$85  (1 unrouted)
  Top 0.254: 96.39,25.15 96.33,25.21 95.89,25.21 95.38,25.72 93.92,25.72 93.6,26.04 R116.2 93.6,28.89 94.23,29.53 94.23,46.23 R115.1
N$86
  Top 0.61: C98.2 95.63,42.42 96.65,41.4 X6.2 104.08,41.4 105.03,40.45 105.03,30.8 105.05,30.78 L10.1
N$87  (1 unrouted)
  Top 0.406: 68.77,63.88 69.28,64.39 IC20.3 IC20.4 IC20.5
N$88  (1 unrouted)
  Top 0.406: IC20.6 70.8,60.58 R120.2
N$89
  Top 0.406: IC20.7 70.74,59.31 R121.2
N$90
  Top 0.406: IC20.1 71.02,66.93 C101.1 70.65,67.25 FB6.P$2
N$91
  Top 0.406: C103.1 86.53,64.39 IC20.14 IC20.13 IC20.12
N$114
  pour Bottom (isolate 0.305, no thermals): 20.51,42.99 20.51,31.69 19.37,30.54 13.78,30.61 12.95,31.43 12.95,42.93 13.91,43.88 19.62,43.88
N$125  (via drill 0.6)
  Top 0.305: FB5.P$1 37,71.41 v36.39,71.44
  Bottom 0.305: X7.4 32.14,71.58 33.21,72.64 35.18,72.64 v36.39,71.44
N$163
  Top 0.254: D21.C 103.06,65.28 105.41,62.93 105.41,46.61 X6.3
SW2  (via drill 0.6)
  Top 0.305: IC16.14 85.42,33.54
  Top 0.356: IC16.15 85.81,34.2 85.85,34.16
  Top 0.813: L9.1 86.48,44.9
  other vias: 90.11,42.16 90.11,43.69 90.11,45.21 90.11,46.74 90.11,48.26 90.11,49.78 90.11,40.64
  pour Top (isolate 0.305, rank 2, no thermals): 81.6,51.5 91.57,51.56 91.57,38.48 89.34,38.42 89.34,35.05 88.27,35.05 86.74,33.53 85.41,33.53 85.34,33.59 83.44,33.59 83.44,34.23 85.34,34.23 85.85,34.73 85.85,38.86 85.53,39.18 81.6,39.18
  pour Bottom (no thermals): 91.25,51.5 84.71,51.5 84.71,39.69 87.5,36.83 91.25,36.83
TA1  (via drill 3.2 pad 6)
  other vias: 96,70
TA2  (via drill 3.2 pad 6)
  other vias: 96,7
TA3  (via drill 3.2 pad 6)
  other vias: 4,70
TA4  (via drill 3.2 pad 6)
  other vias: 4,7
TA5  (via drill 3.2 pad 5.5)
  other vias: 45,65
VIN  (via drill 0.6)
  Top 0.813: L8.1 70.74,32.51 70.48,32.7 v69.53,32.7 | v104.08,11.11 104.08,11.91 IC17.1 | B1.+ 90.43,11.74 v90.42,11.94
  Bottom 0.813: v69.53,32.7 69.53,29.91 71.25,28.19 77.47,28.19 83.76,21.91 C88.+ 83.76,16.13 88.77,11.11 90.42,11.11 | v104.08,11.11 90.42,11.11 | 90.42,11.11 v90.42,11.94
XUSB_GND
  Top 0.406: IC20.2 70.76,65.66 C101.2 68.72,65.57 C104.2
  pour Top (isolate 0.305): 75.56,72.71 75.56,58.04 72.71,55.18 65.47,55.18 63.5,57.15 53.66,57.15 53.66,66.99 55.24,68.58 61.91,68.58 61.91,72.71
  pour Bottom (isolate 0.305): 75.56,72.71 75.56,58.04 72.71,55.18 65.47,55.18 63.5,57.15 53.66,57.15 53.66,66.99 55.24,68.58 61.91,68.58 61.91,72.71
XUSB_VBUS  (1 unrouted)
  Top 0.406: FB6.P$1 64.56,70.51 X9.1 61.47,68.52 C102.2 | IC19.4 61.2,68.66 61.47,68.39
  Bottom 0.254: X9.1 64.01,70.17 62.99,69.15 59.59,69.15 X11.1

### Text on the board
Bottom: EEZ AUX PS (06/2016) r5B8
tPlace: Nin Lin | EEZ AUX PS r5B8 | (06/2016) | Nout Lout | Earth | CAUTION!
bPlace: +3.3V 8 | TX- 7 | TX+ 6 | RX- 5 | RX+ 4 | Shield 3 | LED Active 2 | LED Link 1 | Shield 5 | Gnd 4 | Data+ 3 | Data- 2 | +Vcc 1 | RJ-45 Ethernet X8 | USB (non-isolated) X9 | 10 +5V | 8 +5V | 6 FAN_PWM | 4 PWR_SSTART | 2 Gnd | Fan sense (Yellow) 3 | Fan- (Black) 2 | Fan+ (Red) 1 | Gnd 9 | Sync 7 | FAN_SENSE 5 | PWR_DIRECT 3 | Gnd 1 | Fan X6 | Power X5 | Project source code: github.com/eez-open
_tNames: X8 | FB5 | X9 | C101 | IC20 | C100 | X10 | IC19 | X5 | C102 | D21 | FB6 | C104 | R119 | IC18 | R120 | C103 | X4 | R118 | C84 | R121 | VAR1 | VAR2 | TR2 | FB7 | C93 | L9 | R115 | C92 | R109 | C89 | SAR1 | R108 | C87 | C91 | X6 | C86 | R110 | C98 | D20 | L8 | IC16 | L10 | R114 | D19 | R113 | C94 | C90 | R117 | R116 | ZD7 | C95 | Q22 | C96 | R111 | R112 | C88 | R107 | C99 | ZD6 | OK2 | Q20 | R106 | R102 | KK1 | R104 | B1 | IC17 | R103 | OK1 | R105 | C85 | Q21 | C97
_bNames: X11 | X7